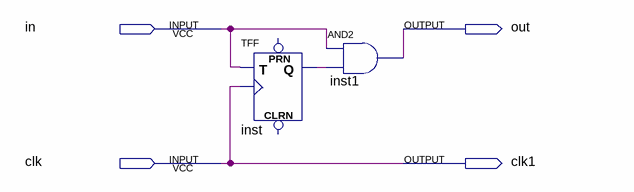
[diagram p0: schematic sheet]
// Quartus schematic div_2.bdf as structural Verilog: 2 symbols, 4 pins
module div_2 (
  input  in,
  input  clk,
  output out,
  output clk1
);

  wire inst_q;

  TFF inst (.T(in), .CLK(clk), .Q(inst_q));  // open: PRN, CLRN
  and inst1 (out, in, inst_q);

  assign clk1 = clk;
endmodule
